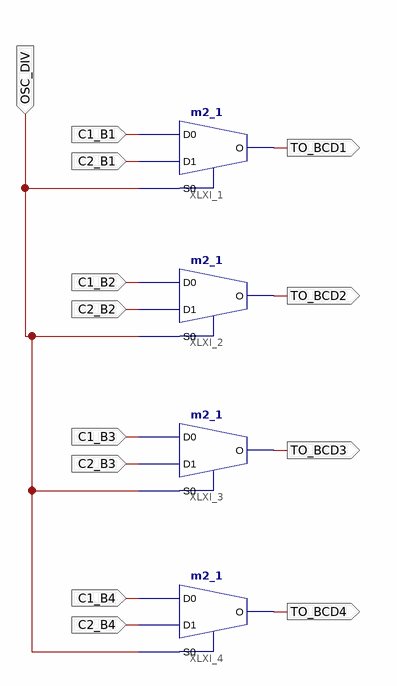
[diagram p0: schematic sheet 1]
// Xilinx ISE schematic Multiplexer_new.sch (spartan6) as structural Verilog: 4 symbols, 13 ports
module Multiplexer_new (
  input  C1_B1,
  input  C2_B1,
  input  C1_B2,
  input  C2_B2,
  input  C1_B3,
  input  C2_B3,
  input  C1_B4,
  input  C2_B4,
  input  OSC_DIV,
  output TO_BCD1,
  output TO_BCD2,
  output TO_BCD3,
  output TO_BCD4
);

  m2_1 XLXI_1 (.D0(C1_B1), .D1(C2_B1), .S0(OSC_DIV), .O(TO_BCD1));
  m2_1 XLXI_2 (.D0(C1_B2), .D1(C2_B2), .S0(OSC_DIV), .O(TO_BCD2));
  m2_1 XLXI_3 (.D0(C1_B3), .D1(C2_B3), .S0(OSC_DIV), .O(TO_BCD3));
  m2_1 XLXI_4 (.D0(C1_B4), .D1(C2_B4), .S0(OSC_DIV), .O(TO_BCD4));
endmodule
